# Altium schematic sheet PAGE119.SchDoc
size 246 x 182 mm
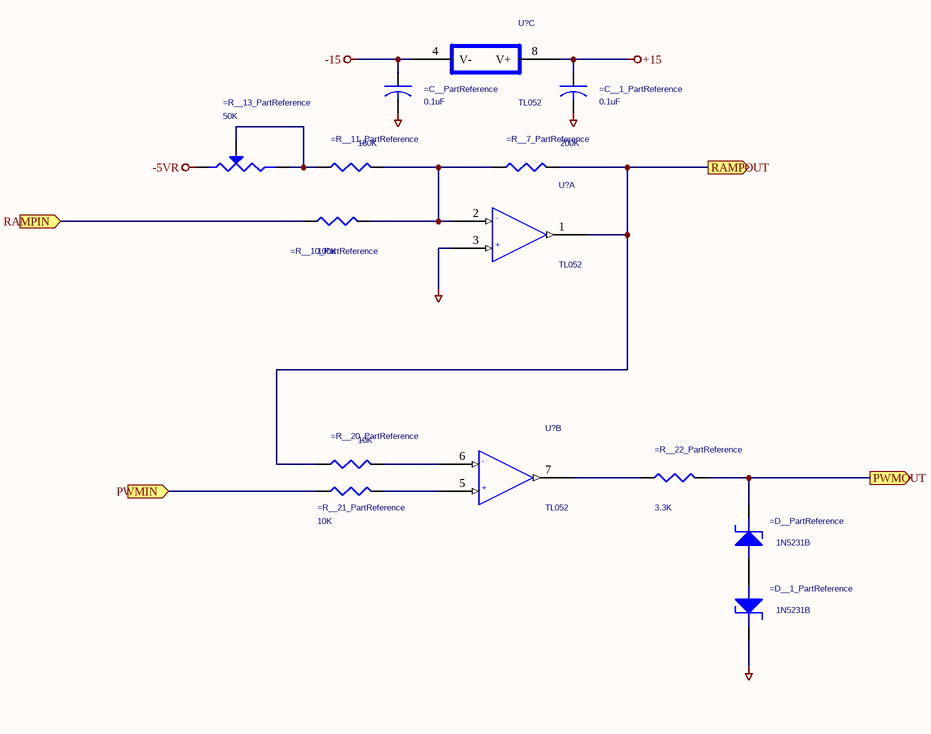
[diagram p0: PAGE119.SchDoc]

## Parts
(Parts that share a designator on the sheet are numbered #1, #2 ... from top to bottom, then left to right.)
=C__1_PartReference  0.1uF  [AXIALCAP0.3]
=C__PartReference  0.1uF  [AXIALCAP0.3]
=D__1_PartReference  1N5231B  [DIODE0.4]
=D__PartReference  1N5231B  [DIODE0.4]
=R__7_PartReference  200K  [AXIAL0.4]
=R__10_PartReference  100K  [AXIAL0.4]
=R__11_PartReference  180K  [AXIAL0.4]
=R__13_PartReference  50K  [TRIMPOT-3006]
=R__20_PartReference  10K  [AXIAL0.4]
=R__21_PartReference  10K  [AXIAL0.4]
=R__22_PartReference  3.3K  [AXIAL0.4]
U?#1  TL052  [DIP8]  (part C of 3)
U?#2  TL052  [DIP8]  (part A of 3)
U?#3  TL052  [DIP8]  (part B of 3)

## Ports
PWMIN (in), PWMOUT (out), RAMPIN (in), RAMPOUT (out)

## Nets
+15: =C__1_PartReference.1 U?#1.8(V+)
-5VR: =R__13_PartReference.A
-15: =C__PartReference.1 U?#1.4(V-)
AGND: =C__1_PartReference.2 =C__PartReference.2 =D__1_PartReference.CATHODE U?#2.3(+)
PWMIN: =R__21_PartReference.1 ; port PWMIN
PWMOUT: =D__PartReference.CATHODE =R__22_PartReference.2 ; port PWMOUT
RAMPIN: =R__10_PartReference.1 ; port RAMPIN
RAMPOUT: =R__7_PartReference.2 =R__20_PartReference.1 U?#2.1(OUT) ; port RAMPOUT
Net=D__1_PartReference_ANODE: =D__1_PartReference.ANODE =D__PartReference.ANODE
Net=R__7_PartReference_1: =R__7_PartReference.1 =R__10_PartReference.2 =R__11_PartReference.2 U?#2.2(-)
Net=R__11_PartReference_1: =R__11_PartReference.1 =R__13_PartReference.B =R__13_PartReference.WIPER
Net=R__20_PartReference_2: =R__20_PartReference.2 U?#3.6(-)
Net=R__21_PartReference_2: =R__21_PartReference.2 U?#3.5(+)
Net=R__22_PartReference_1: =R__22_PartReference.1 U?#3.7(OUT)

## Library data of the parts
=C__1_PartReference =C__PartReference = CAP_Dup1
=D__1_PartReference =D__PartReference = DIODE ZENER
=R__7_PartReference =R__10_PartReference =R__11_PartReference =R__20_PartReference =R__21_PartReference =R__22_PartReference = R_Dup1
=R__13_PartReference = POT
U?#1-U?#3 = GEN DUAL OPAMP-H: PACKAGE: RAMP_PWM